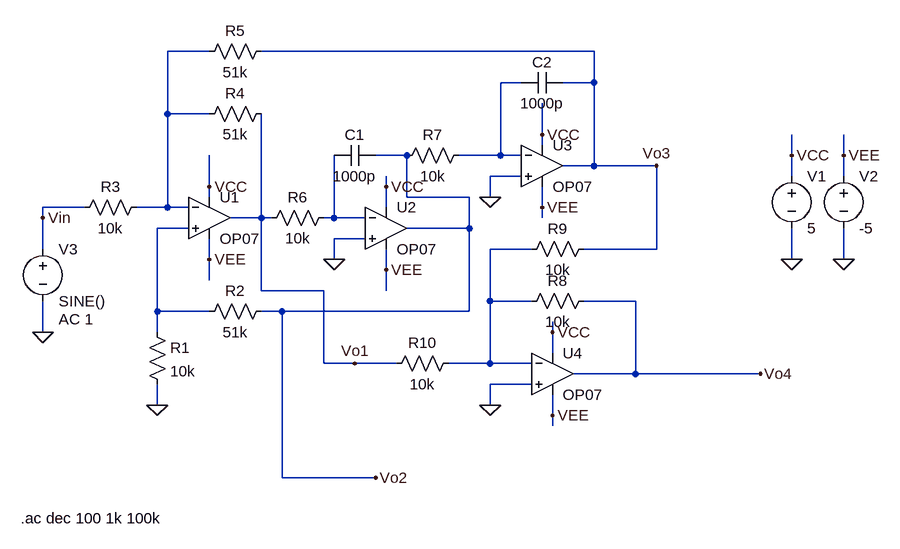
[diagram p0: schematic 1_8.asc]
1_8.asc, the LTspice schematic file:
Version 4
SHEET 1 1112 680
WIRE 80 -128 16 -128
WIRE 672 -128 160 -128
WIRE 560 -80 528 -80
WIRE 672 -80 672 -128
WIRE 672 -80 624 -80
WIRE 16 -32 16 -128
WIRE 80 -32 16 -32
WIRE 592 0 592 -48
WIRE 592 16 592 0
WIRE 384 32 336 32
WIRE 528 32 528 -80
WIRE 528 32 464 32
WIRE 560 32 528 32
WIRE 976 32 976 0
WIRE 1056 32 1056 0
WIRE 672 48 672 -80
WIRE 672 48 624 48
WIRE 768 48 672 48
WIRE 560 64 512 64
WIRE 976 64 976 32
WIRE 1056 64 1056 32
WIRE 80 80 80 32
WIRE 352 80 352 64
WIRE 80 96 80 80
WIRE 384 96 384 32
WIRE 480 96 384 96
WIRE 512 96 512 64
WIRE -112 112 -176 112
WIRE 16 112 16 -32
WIRE 16 112 -32 112
WIRE 48 112 16 112
WIRE 352 112 352 80
WIRE 592 112 592 80
WIRE -176 128 -176 112
WIRE 160 128 160 -32
WIRE 160 128 112 128
WIRE 176 128 160 128
WIRE 272 128 272 32
WIRE 272 128 256 128
WIRE 320 128 272 128
WIRE 592 128 592 112
WIRE 48 144 0 144
WIRE 480 144 480 96
WIRE 480 144 384 144
WIRE 320 160 272 160
WIRE -176 176 -176 128
WIRE 576 176 512 176
WIRE 768 176 768 48
WIRE 768 176 656 176
WIRE 80 192 80 160
WIRE 272 192 272 160
WIRE 976 192 976 144
WIRE 1056 192 1056 144
WIRE 352 208 352 176
WIRE 80 224 80 192
WIRE 160 240 160 128
WIRE 256 240 160 240
WIRE 352 240 352 208
WIRE 512 256 512 176
WIRE 576 256 512 256
WIRE 736 256 656 256
WIRE 0 272 0 144
WIRE 80 272 0 272
WIRE 192 272 160 272
WIRE 480 272 480 144
WIRE 480 272 192 272
WIRE -176 304 -176 256
WIRE 0 304 0 272
WIRE 608 304 608 288
WIRE 608 336 608 304
WIRE 256 352 256 240
WIRE 304 352 256 352
WIRE 368 352 304 352
WIRE 512 352 512 256
WIRE 512 352 448 352
WIRE 576 352 512 352
WIRE 736 368 736 256
WIRE 736 368 640 368
WIRE 928 368 736 368
WIRE 576 384 512 384
WIRE 0 416 0 384
WIRE 512 416 512 384
WIRE 608 432 608 400
WIRE 608 448 608 432
WIRE 192 528 192 272
WIRE 336 528 192 528
FLAG 0 416 0
FLAG 512 416 0
FLAG 512 96 0
FLAG 272 192 0
FLAG 336 528 Vo2
FLAG 928 368 Vo4
FLAG 304 352 Vo1
FLAG 768 48 Vo3
FLAG 976 192 0
FLAG 1056 192 0
FLAG 976 32 VCC
FLAG 592 0 VCC
FLAG 80 80 VCC
FLAG 352 80 VCC
FLAG 608 304 VCC
FLAG 1056 32 VEE
FLAG 592 112 VEE
FLAG 608 432 VEE
FLAG 352 208 VEE
FLAG 80 192 VEE
FLAG -176 304 0
FLAG -176 128 Vin
SYMBOL OpAmps\\OP07 80 64 R0
SYMATTR InstName U1
SYMBOL OpAmps\\OP07 352 80 R0
SYMATTR InstName U2
SYMBOL OpAmps\\OP07 592 -16 R0
SYMATTR InstName U3
SYMBOL OpAmps\\OP07 608 304 R0
SYMATTR InstName U4
SYMBOL res -16 288 R0
SYMATTR InstName R1
SYMATTR Value 10k
SYMBOL res 176 256 R90
WINDOW 0 0 56 VBottom 2
WINDOW 3 32 56 VTop 2
SYMATTR InstName R2
SYMATTR Value 51k
SYMBOL res -16 96 R90
WINDOW 0 0 56 VBottom 2
WINDOW 3 32 56 VTop 2
SYMATTR InstName R3
SYMATTR Value 10k
SYMBOL res 176 -48 R90
WINDOW 0 0 56 VBottom 2
WINDOW 3 32 56 VTop 2
SYMATTR InstName R4
SYMATTR Value 51k
SYMBOL res 176 -144 R90
WINDOW 0 0 56 VBottom 2
WINDOW 3 32 56 VTop 2
SYMATTR InstName R5
SYMATTR Value 51k
SYMBOL res 272 112 R90
WINDOW 0 0 56 VBottom 2
WINDOW 3 32 56 VTop 2
SYMATTR InstName R6
SYMATTR Value 10k
SYMBOL cap 272 16 M90
WINDOW 0 0 32 VBottom 2
WINDOW 3 32 32 VTop 2
SYMATTR InstName C1
SYMATTR Value 1000p
SYMBOL res 480 16 R90
WINDOW 0 0 56 VBottom 2
WINDOW 3 32 56 VTop 2
SYMATTR InstName R7
SYMATTR Value 10k
SYMBOL cap 624 -96 R90
WINDOW 0 0 32 VBottom 2
WINDOW 3 32 32 VTop 2
SYMATTR InstName C2
SYMATTR Value 1000p
SYMBOL res 672 240 R90
WINDOW 0 0 56 VBottom 2
WINDOW 3 32 56 VTop 2
SYMATTR InstName R8
SYMATTR Value 10k
SYMBOL res 672 160 R90
WINDOW 0 0 56 VBottom 2
WINDOW 3 32 56 VTop 2
SYMATTR InstName R9
SYMATTR Value 10k
SYMBOL res 464 336 R90
WINDOW 0 0 56 VBottom 2
WINDOW 3 32 56 VTop 2
SYMATTR InstName R10
SYMATTR Value 10k
SYMBOL voltage 976 48 R0
WINDOW 123 0 0 Left 0
WINDOW 39 0 0 Left 0
SYMATTR InstName V1
SYMATTR Value 5
SYMBOL voltage 1056 48 R0
WINDOW 123 0 0 Left 0
WINDOW 39 0 0 Left 0
SYMATTR InstName V2
SYMATTR Value -5
SYMBOL voltage -176 160 R0
WINDOW 123 24 124 Left 2
WINDOW 39 0 0 Left 0
SYMATTR InstName V3
SYMATTR Value SINE()
SYMATTR Value2 AC 1
TEXT -210 590 Left 2 !.ac dec 100 1k 100k

The netlist it stands for:
* 1_8.asc
XU1 N004 N001 VCC VEE Vo1 LT1001  ; OP07, pins In+ In- V+ V- OUT
XU2 0 N003 VCC VEE Vo2 LT1001  ; OP07, pins In+ In- V+ V- OUT
XU3 0 N002 VCC VEE Vo3 LT1001  ; OP07, pins In+ In- V+ V- OUT
XU4 0 N005 VCC VEE Vo4 LT1001  ; OP07, pins In+ In- V+ V- OUT
R1 N004 0 10k
R2 Vo2 N004 51k
R3 N001 Vin 10k
R4 Vo1 N001 51k
R5 Vo3 N001 51k
R6 N003 Vo1 10k
C1 N003 Vo2 1000p
R7 N002 Vo2 10k
C2 Vo3 N002 1000p
R8 Vo4 N005 10k
R9 Vo3 N005 10k
R10 N005 Vo1 10k
V1 VCC 0 5
V2 VEE 0 -5
V3 Vin 0 SINE() AC 1
.ac dec 100 1k 100k
.lib LTC.lib
.backanno
.end

* Results of the author's LTspice run, read from the files saved beside the schematic
* Operating Point, zero values left out:
*   V(vcc) = 5 V
*   V(vee) = -5 V
*   I(V2) = 9 mA
*   I(V1) = -9 mA
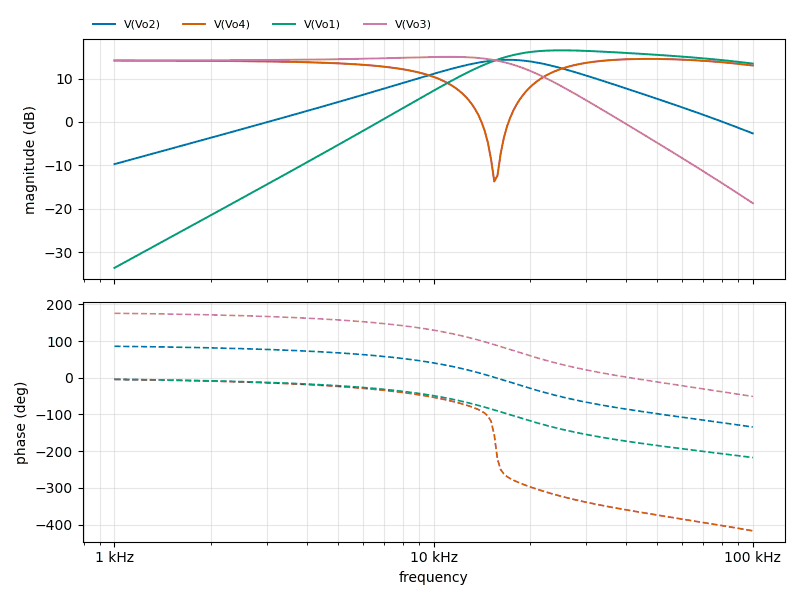
[diagram p1: AC Analysis of 1_8.asc, plotted from the saved traces]
* AC Analysis, 1 run:
*   V(Vo2): -9.71 dB at 1 kHz, -2.64 dB at 100 kHz, peak 14.31 dB at 16.98 kHz, 3 dB below the peak at 10.24 kHz and 28.21 kHz
*   V(Vo4): 14.13 dB at 1 kHz, 12.98 dB at 100 kHz, peak 14.51 dB at 46.77 kHz, 3 dB below the peak at 23.69 kHz
*   V(Vo1): -33.59 dB at 1 kHz, 13.43 dB at 100 kHz, peak 16.49 dB at 25.12 kHz, 3 dB below the peak at 14.74 kHz and 98.81 kHz
*   V(Vo3): 14.16 dB at 1 kHz, -18.70 dB at 100 kHz, peak 14.99 dB at 11.22 kHz, 3 dB below the peak at 19.72 kHz